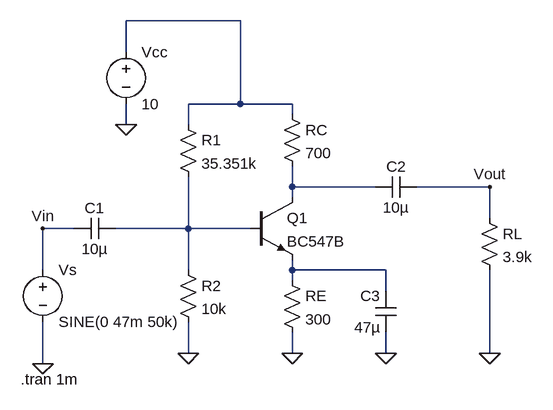
[diagram p0: schematic lab7.1b.asc]
lab7.1b.asc, the LTspice schematic file:
Version 4
SHEET 1 880 680
WIRE 368 -176 192 -176
WIRE 192 -128 192 -176
WIRE 368 -48 368 -176
WIRE 368 -48 288 -48
WIRE 448 -48 368 -48
WIRE 448 -32 448 -48
WIRE 192 -16 192 -48
WIRE 288 -16 288 -48
WIRE 448 80 448 48
WIRE 576 80 448 80
WIRE 752 80 640 80
WIRE 448 96 448 80
WIRE 752 128 752 80
WIRE 112 144 64 144
WIRE 288 144 288 64
WIRE 288 144 176 144
WIRE 384 144 288 144
WIRE 64 208 64 144
WIRE 288 208 288 144
WIRE 448 208 448 192
WIRE 592 208 448 208
WIRE 448 224 448 208
WIRE 592 240 592 208
WIRE 288 336 288 288
WIRE 448 336 448 304
WIRE 592 336 592 304
WIRE 752 336 752 208
WIRE 64 352 64 288
FLAG 64 352 0
FLAG 288 336 0
FLAG 448 336 0
FLAG 592 336 0
FLAG 752 336 0
FLAG 192 -16 0
FLAG 752 80 Vout
FLAG 64 144 Vin
SYMBOL voltage 64 192 R0
WINDOW 123 0 0 Left 0
WINDOW 39 0 0 Left 0
SYMATTR InstName Vs
SYMATTR Value SINE(0 47m 50k)
SYMBOL res 272 -32 R0
SYMATTR InstName R1
SYMATTR Value 35.351k
SYMBOL res 272 192 R0
SYMATTR InstName R2
SYMATTR Value 10k
SYMBOL res 432 -48 R0
SYMATTR InstName RC
SYMATTR Value 700
SYMBOL res 432 208 R0
SYMATTR InstName RE
SYMATTR Value 300
SYMBOL cap 640 64 R90
WINDOW 0 0 32 VBottom 2
WINDOW 3 32 32 VTop 2
SYMATTR InstName C2
SYMATTR Value 10µ
SYMBOL cap 608 304 R180
WINDOW 0 24 56 Left 2
WINDOW 3 24 8 Left 2
SYMATTR InstName C3
SYMATTR Value 47µ
SYMBOL res 736 112 R0
SYMATTR InstName RL
SYMATTR Value 3.9k
SYMBOL npn 384 96 R0
SYMATTR InstName Q1
SYMATTR Value BC547B
SYMBOL voltage 192 -144 R0
SYMATTR InstName Vcc
SYMATTR Value 10
SYMBOL cap 176 128 R90
WINDOW 0 0 32 VBottom 2
WINDOW 3 32 32 VTop 2
SYMATTR InstName C1
SYMATTR Value 10µ
TEXT 30 376 Left 2 !.tran 1m

The netlist it stands for:
* lab7.1b.asc
Vs Vin 0 SINE(0 47m 50k)
R1 N001 N003 35.351k
R2 N003 0 10k
RC N001 N002 700
RE N004 0 300
C2 Vout N002 10µ
C3 0 N004 47µ
RL Vout 0 3.9k
Q1 N002 N003 N004 0 BC547B
Vcc N001 0 10
C1 N003 Vin 10µ
.model NPN NPN
.model PNP PNP
.lib standard.bjt
.tran 1m
.backanno
.end